# Altium schematic sheet PATHOS_SOM_UART.SchDoc: UART Connectors
size A4; Author: A. Kalberer; CompanyName: NTB; Organization: NTB Interstate University of Applied; Address1: Werdenbergstrasse 4; Address3: 9471 Buchs; Address4: Switzerland; Organization1: Sciences of Technology Buchs; Size: A4
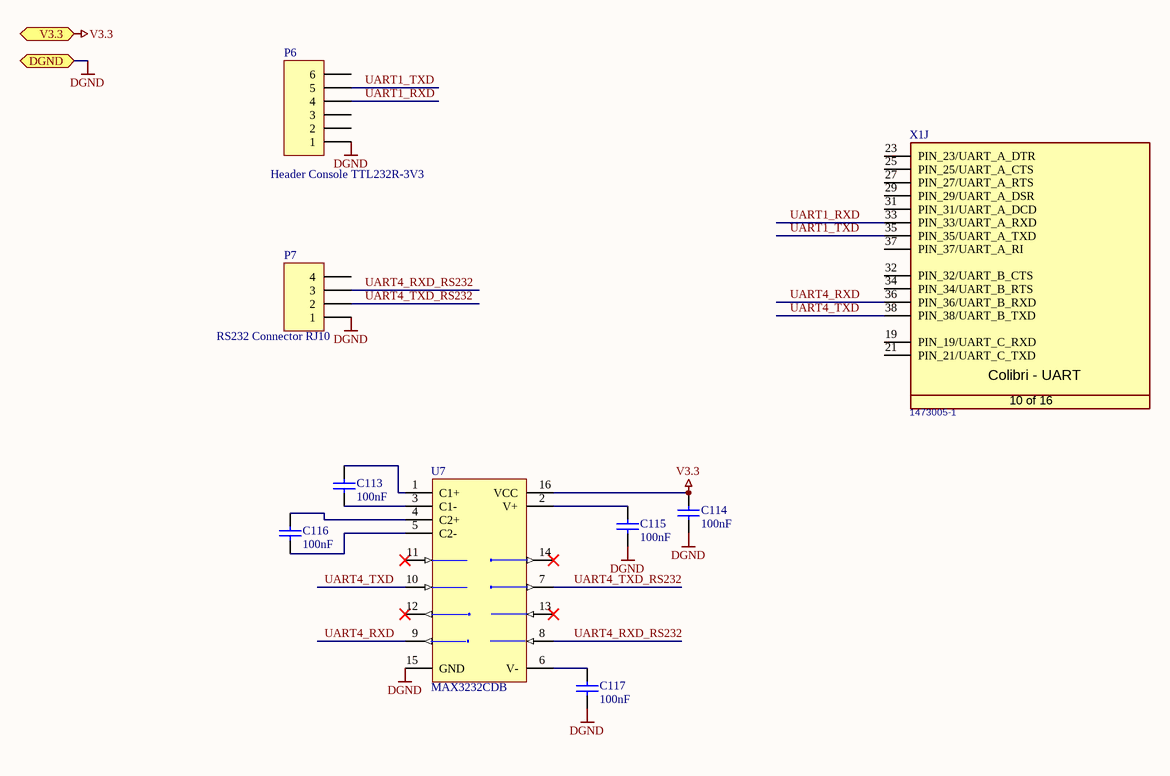
[diagram p0: PATHOS_SOM_UART.SchDoc]

## Parts
C113  100nF  [0603_3D]
C114  100nF  [0603_3D]
C115  100nF  [0603_3D]
C116  100nF  [0603_3D]
C117  100nF  [0603_3D]
P6  Header Console TTL232R-3V3  [Header - 1x6 - V]
P7  RS232 Connector RJ10  [95009-2447]
U7  MAX3232CDB  [SSOP16_M_thinPins]
X1  Manufacturer Part No.: 1473005-1  [T_Tyco_1473005-1]  (hidden comment: CON-Tyco-1473005-1-200-0.6mm)  (part J of 16)

## Ports
DGND, V3.3

## Nets
DGND: C114.1 C115.1 C117.1 P6.1 P7.1 U7.15(GND) ; port DGND
V3.3: C114.2 U7.16(VCC) ; port V3.3
UART1_RXD: P6.4 X1.33(PIN_33/UART_A_RXD)
UART1_TXD: P6.5 X1.35(PIN_35/UART_A_TXD)
UART4_RXD: U7.9(R2OUT) X1.36(PIN_36/UART_B_RXD)
UART4_RXD_RS232: P7.3 U7.8(R2IN)
UART4_TXD: U7.10(T2IN) X1.38(PIN_38/UART_B_TXD)
UART4_TXD_RS232: P7.2 U7.7(T2OUT)
NetC113_1: C113.1 U7.3(C1-)
NetC113_2: C113.2 U7.1(C1+)
NetC115_2: C115.2 U7.2(V+)
NetC116_1: C116.1 U7.5(C2-)
NetC116_2: C116.2 U7.4(C2+)
NetC117_2: C117.2 U7.6(V-)

Not connected (* = marked no-connect by the designer): P6 2 3 6; P7 4; U7 11(T1IN)* 12(R1OUT)* 13(R1IN)* 14(T1OUT)*; X1 19(PIN_19/UART_C_RXD) 21(PIN_21/UART_C_TXD) 23(PIN_23/UART_A_DTR) 25(PIN_25/UART_A_CTS) 27(PIN_27/UART_A_RTS) 29(PIN_29/UART_A_DSR) 31(PIN_31/UART_A_DCD) 32(PIN_32/UART_B_CTS) 34(PIN_34/UART_B_RTS) 37(PIN_37/UART_A_RI)

## Notes on the sheet
- Title:
- Description:
- Size:
- Date:
- Name:
- Number:
- Time:
- Revision:
- Sheet
- Checked:
- of
- File:
- (in symbol CON-Tyco-1473005-1-200-0.6mm, part J) Colibri - UART; 10 of 16

## Library data of the parts
C113-C117 = C: Capacitor; #Manufacturer: Generic Components; #Publisher: Dr. A. Heinzelmann; #Class: Passive; Initial Voltage: 0V; #Published: 2006-10-07; #ClassSub: Capacitor; Type: *; Voltage Maximum: *; Value: 100nF
P6 = Header 1x6: Header, 6-Pin; LatestRevisionDate: 17-Jul-2002; LatestRevisionNote: Re-released for DXP Platform.; Publisher: Altium Limited
P7 = Header 4: Header, 4-Pin; LatestRevisionDate: 17-Jul-2002; LatestRevisionNote: Re-released for DXP Platform.; Publisher: Altium Limited
U7 = MAX3232ECAE: ±15kV ESD-Protected, 3.0V to 5.5V, Low-Power, up to 250kbps, True RS-232 Transceiver; Published: 16-Jan-2001; LatestRevisionDate: 29-May-2009; LatestRevisionNote: IPC-7351 Footprint Added.; DatasheetVersion: Mar-1999; PackageVersion: 1996; PackageReference: SSOP16; Publisher: Altium Limited; PackageDescription: 16-Pin Small Outline Package 0.65 mm Pitch; Code_JEDEC: MO-150-AC; Code_IPC: SOP65P780-16; ComponentLink1Description: Manufacturer Link; ComponentLink1URL: http://www.maxim-ic.com/; ComponentLink2Description: Datasheet; ComponentLink2URL: http://pdfserv.maxim-ic.com/en/ds/MAX3222E-MAX3246E.pdf
X1 = CON-Tyco-1473005-1-200-0.6mm: SODIMM Connector; Manufacturer Name: Tyco; No. of ways: 200